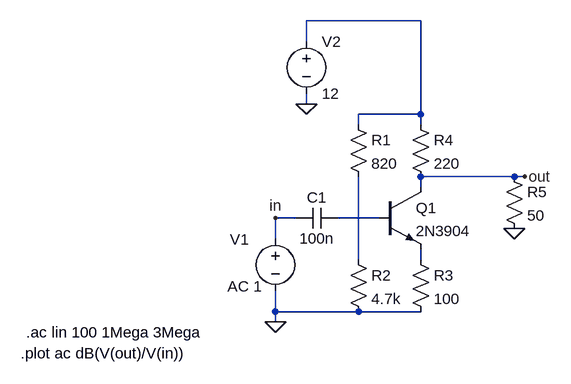
[diagram p0: schematic rf-amp.asc]
rf-amp.asc, the LTspice schematic file:
Version 4.1
SHEET 1 880 680
WIRE 528 -176 352 -176
WIRE 352 -144 352 -176
WIRE 352 -48 352 -64
WIRE 528 -32 528 -176
WIRE 528 -32 432 -32
WIRE 432 -16 432 -32
WIRE 528 -16 528 -32
WIRE 672 64 528 64
WIRE 688 64 672 64
WIRE 528 80 528 64
WIRE 336 128 304 128
WIRE 464 128 400 128
WIRE 304 160 304 128
WIRE 432 192 432 64
WIRE 528 192 528 176
WIRE 304 272 304 240
WIRE 432 272 304 272
WIRE 528 272 432 272
WIRE 304 288 304 272
FLAG 352 -48 0
FLAG 304 288 0
FLAG 688 64 out
FLAG 672 144 0
FLAG 304 128 in
SYMBOL npn 464 80 R0
SYMATTR InstName Q1
SYMATTR Value 2N3904
SYMBOL voltage 304 144 R0
WINDOW 0 -70 17 Left 2
WINDOW 3 -210 95 Left 2
WINDOW 123 -74 89 Left 2
WINDOW 39 0 0 Left 0
SYMATTR InstName V1
SYMATTR Value ""
SYMATTR Value2 AC 1
SYMBOL cap 400 112 R90
WINDOW 0 0 32 VBottom 2
WINDOW 3 32 32 VTop 2
SYMATTR InstName C1
SYMATTR Value 100n
SYMBOL res 416 -32 R0
SYMATTR InstName R1
SYMATTR Value 820
SYMBOL res 416 176 R0
SYMATTR InstName R2
SYMATTR Value 4.7k
SYMBOL res 512 176 R0
SYMATTR InstName R3
SYMATTR Value 100
SYMBOL res 512 -32 R0
SYMATTR InstName R4
SYMATTR Value 220
SYMBOL voltage 352 -160 R0
SYMATTR InstName V2
SYMATTR Value 12
SYMBOL res 656 48 R0
SYMATTR InstName R5
SYMATTR Value 50
TEXT -88 336 Left 2 !.plot ac dB(V(out)/V(in))
TEXT -80 304 Left 2 !.ac lin 100 1Mega 3Mega

The netlist it stands for:
* rf-amp.asc
Q1 out N002 N004 0 2N3904
V1 in 0 AC 1
C1 N002 in 100n
R1 N001 N003 820
R2 N003 0 4.7k
R3 N004 0 100
R4 N001 out 220
V2 N001 0 12
R5 out 0 50
.model NPN NPN
.model PNP PNP
.lib standard.bjt
.plot ac dB(V(out)/V(in))
.ac lin 100 1Mega 3Mega
.backanno
.end